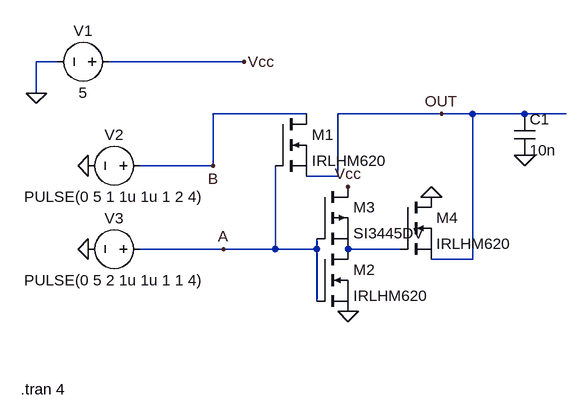
[diagram p0: schematic AND PTL.asc]
AND PTL.asc, the LTspice schematic file:
Version 4.1
SHEET 1 880 680
WIRE -128 -16 -160 -16
WIRE 160 -16 -48 -16
WIRE -160 32 -160 -16
WIRE 256 64 112 64
WIRE 464 64 304 64
WIRE 512 64 464 64
WIRE 592 64 512 64
WIRE 656 64 592 64
WIRE 112 144 112 64
WIRE 112 144 0 144
WIRE 304 160 304 64
WIRE 304 160 256 160
WIRE 128 272 0 272
WIRE 208 272 208 144
WIRE 208 272 128 272
WIRE 272 272 272 256
WIRE 272 272 208 272
WIRE 400 272 320 272
WIRE 512 288 512 64
WIRE 512 288 448 288
WIRE 272 352 272 272
FLAG -160 32 0
FLAG 160 -16 Vcc
FLAG -80 144 0
FLAG -80 272 0
FLAG 320 176 Vcc
FLAG 320 368 0
FLAG 464 64 OUT
FLAG 592 128 0
FLAG 128 272 A
FLAG 112 144 B
FLAG 448 192 0
SYMBOL voltage -32 -16 R90
WINDOW 0 -32 56 VBottom 2
WINDOW 3 32 56 VTop 2
WINDOW 123 0 0 Left 0
WINDOW 39 0 0 Left 0
SYMATTR InstName V1
SYMATTR Value 5
SYMBOL voltage 16 144 R90
WINDOW 0 -32 56 VBottom 2
WINDOW 3 32 56 VTop 2
WINDOW 123 0 0 Left 0
WINDOW 39 0 0 Left 0
SYMATTR InstName V2
SYMATTR Value PULSE(0 5 1 1u 1u 1 2 4)
SYMBOL voltage 16 272 R90
WINDOW 0 -32 56 VBottom 2
WINDOW 3 32 56 VTop 2
WINDOW 123 0 0 Left 0
WINDOW 39 0 0 Left 0
SYMATTR InstName V3
SYMATTR Value PULSE(0 5 2 1u 1u 1 1 4)
SYMBOL nmos 208 64 R0
SYMATTR InstName M1
SYMATTR Value IRLHM620
SYMBOL pmos 272 176 R0
SYMATTR InstName M3
SYMATTR Value SI3445DV
SYMBOL nmos 272 272 R0
SYMATTR InstName M2
SYMATTR Value IRLHM620
SYMBOL nmos 400 192 R0
SYMATTR InstName M4
SYMATTR Value IRLHM620
SYMBOL cap 576 64 R0
SYMATTR InstName C1
SYMATTR Value 10n
TEXT -184 488 Left 2 !.tran 4

The netlist it stands for:
* AND PTL.asc
V1 Vcc 0 5
V2 B 0 PULSE(0 5 1 1u 1u 1 2 4)
V3 A 0 PULSE(0 5 2 1u 1u 1 1 4)
M1 B A OUT OUT IRLHM620
M3 Vcc A N001 N001 SI3445DV
M2 N001 A 0 0 IRLHM620
M4 0 N001 OUT OUT IRLHM620
C1 OUT 0 10n
.model NMOS NMOS
.model PMOS PMOS
.lib standard.mos
.tran 4
.backanno
.end